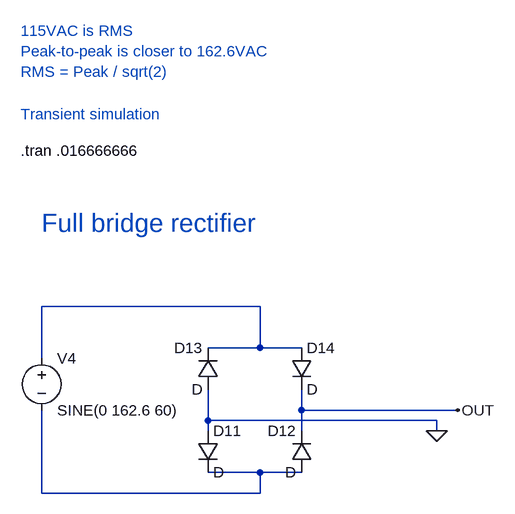
[diagram p0: schematic 2025-09-22 3-Phase Rectifier.asc]
2025-09-22 3-Phase Rectifier.asc, the LTspice schematic file:
Version 4.1
SHEET 1 2844 1620
WIRE 944 1072 608 1072
WIRE 944 1136 944 1072
WIRE 944 1136 864 1136
WIRE 1008 1136 944 1136
WIRE 608 1152 608 1072
WIRE 1008 1232 1008 1200
WIRE 1248 1232 1008 1232
WIRE 864 1248 864 1200
WIRE 1216 1248 864 1248
WIRE 864 1264 864 1248
WIRE 1008 1264 1008 1232
WIRE 1216 1264 1216 1248
WIRE 944 1328 864 1328
WIRE 1008 1328 944 1328
WIRE 608 1360 608 1232
WIRE 944 1360 944 1328
WIRE 944 1360 608 1360
FLAG 1216 1264 0
FLAG 1248 1232 OUT
SYMBOL voltage 608 1136 R0
WINDOW 123 0 0 Left 2
WINDOW 39 0 0 Left 2
SYMATTR InstName V4
SYMATTR Value SINE(0 162.6 60)
SYMBOL diode 848 1264 R0
SYMATTR InstName D11
SYMBOL diode 1024 1328 R180
WINDOW 0 24 64 Left 2
WINDOW 3 24 0 Left 2
SYMATTR InstName D12
SYMBOL diode 880 1200 R180
WINDOW 0 24 64 Left 2
WINDOW 3 24 0 Left 2
SYMATTR InstName D13
SYMBOL diode 992 1136 R0
SYMATTR InstName D14
TEXT 608 944 Left 4 ;Full bridge rectifier
TEXT 576 832 Left 2 !.tran .016666666
TEXT 576 776 Left 2 ;Transient simulation
TEXT 576 648 Left 2 ;115VAC is RMS\nPeak-to-peak is closer to 162.6VAC\nRMS = Peak / sqrt(2)

The netlist it stands for:
* 2025-09-22 3-Phase Rectifier.asc
V4 N001 N002 SINE(0 162.6 60)
D11 0 N002 D
D12 N002 OUT D
D13 0 N001 D
D14 N001 OUT D
.model D D
.lib standard.dio
* Full bridge rectifier
.tran .016666666
* Transient simulation
* 115VAC is RMS
* Peak-to-peak is closer to 162.6VAC
* RMS = Peak / sqrt(2)
.backanno
.end